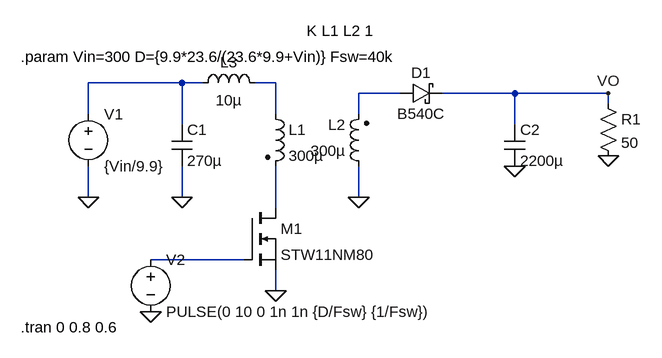
[diagram p0: schematic Draft2.asc]
Draft2.asc, the LTspice schematic file:
Version 4
SHEET 1 948 680
WIRE 224 96 80 96
WIRE 256 96 224 96
WIRE 368 96 336 96
WIRE 560 112 496 112
WIRE 736 112 624 112
WIRE 880 112 736 112
WIRE 880 128 880 112
WIRE 80 144 80 96
WIRE 368 144 368 96
WIRE 496 144 496 112
WIRE 224 160 224 96
WIRE 736 160 736 112
WIRE 80 272 80 224
WIRE 224 272 224 224
WIRE 496 272 496 224
WIRE 368 288 368 224
WIRE 320 368 176 368
WIRE 368 416 368 384
FLAG 80 272 0
FLAG 224 272 0
FLAG 368 416 0
FLAG 176 448 0
FLAG 496 272 0
FLAG 736 224 0
FLAG 880 208 0
FLAG 880 112 VO
SYMBOL voltage 80 128 R0
WINDOW 123 0 0 Left 0
WINDOW 39 0 0 Left 0
SYMATTR InstName V1
SYMATTR Value {Vin/9.9}
SYMBOL cap 208 160 R0
SYMATTR InstName C1
SYMATTR Value 270µ
SYMBOL ind2 352 128 R0
SYMATTR InstName L1
SYMATTR Value 300µ
SYMATTR Type ind
SYMBOL nmos 320 288 R0
SYMATTR InstName M1
SYMATTR Value STW11NM80
SYMBOL voltage 176 352 R0
WINDOW 123 0 0 Left 0
WINDOW 39 0 0 Left 0
SYMATTR InstName V2
SYMATTR Value PULSE(0 10 0 1n 1n {D/Fsw} {1/Fsw})
SYMBOL ind2 512 240 R180
WINDOW 0 36 80 Left 2
WINDOW 3 36 40 Left 2
SYMATTR InstName L2
SYMATTR Value 300µ
SYMATTR Type ind
SYMBOL schottky 560 128 R270
WINDOW 0 32 32 VTop 2
WINDOW 3 0 32 VBottom 2
SYMATTR InstName D1
SYMATTR Value B540C
SYMATTR Description Diode
SYMATTR Type diode
SYMBOL cap 720 160 R0
SYMATTR InstName C2
SYMATTR Value 2200µ
SYMBOL res 864 112 R0
SYMATTR InstName R1
SYMATTR Value 50
SYMBOL ind 240 112 R270
WINDOW 0 32 56 VTop 2
WINDOW 3 5 56 VBottom 2
SYMATTR InstName L3
SYMATTR Value 10µ
TEXT -24 56 Left 2 !.param Vin=300 D={9.9*23.6/(23.6*9.9+Vin)} Fsw=40k
TEXT 416 16 Left 2 !K L1 L2 1
TEXT -24 472 Left 2 !.tran 0 0.8 0.6

The netlist it stands for:
* Draft2.asc
V1 N001 0 {Vin/9.9}
C1 N001 0 270µ
L1 N002 N004 300µ
M1 N004 N005 0 0 STW11NM80
V2 N005 0 PULSE(0 10 0 1n 1n {D/Fsw} {1/Fsw})
L2 0 N003 300µ
D1 N003 VO B540C
C2 VO 0 2200µ
R1 VO 0 50
L3 N001 N002 10µ
.model D D
.lib standard.dio
.model NMOS NMOS
.model PMOS PMOS
.lib standard.mos
.param Vin=300 D={9.9*23.6/(23.6*9.9+Vin)} Fsw=40k
K L1 L2 1
.tran 0 0.8 0.6
.backanno
.end